# Altium schematic sheet [01] BLOCK_DIAGRAM.SchDoc
size A4; SheetNumber: 2; SheetTotal: 10
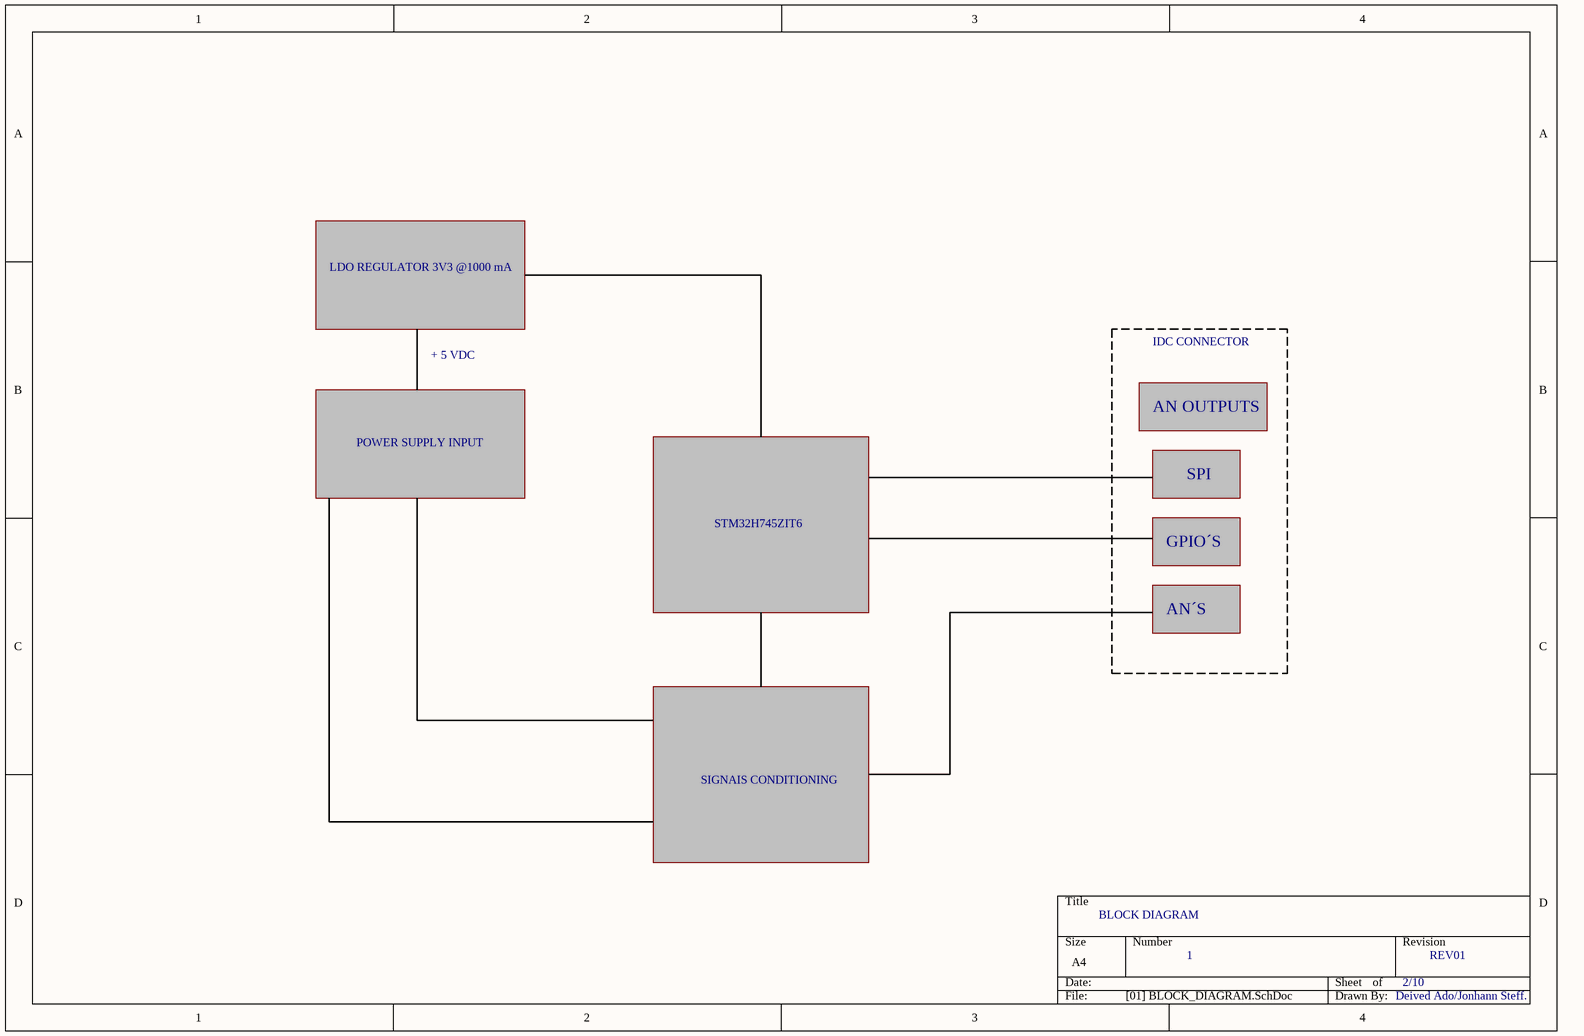
[diagram p0: [01] BLOCK_DIAGRAM.SchDoc]

## Notes on the sheet
- LDO REGULATOR 3V3 @1000 mA
- + 5 VDC
- IDC CONNECTOR
- POWER SUPPLY INPUT
- AN OUTPUTS
- SPI
- STM32H745ZIT6
- GPIO´S
- AN´S
- SIGNAIS CONDITIONING
- BLOCK DIAGRAM
- 1
- 2/10
- REV01
- Deived Ado/Jonhann Steff.